# Altium project RPi-HAT-RAK831-PoE-PCB.PrjPcb
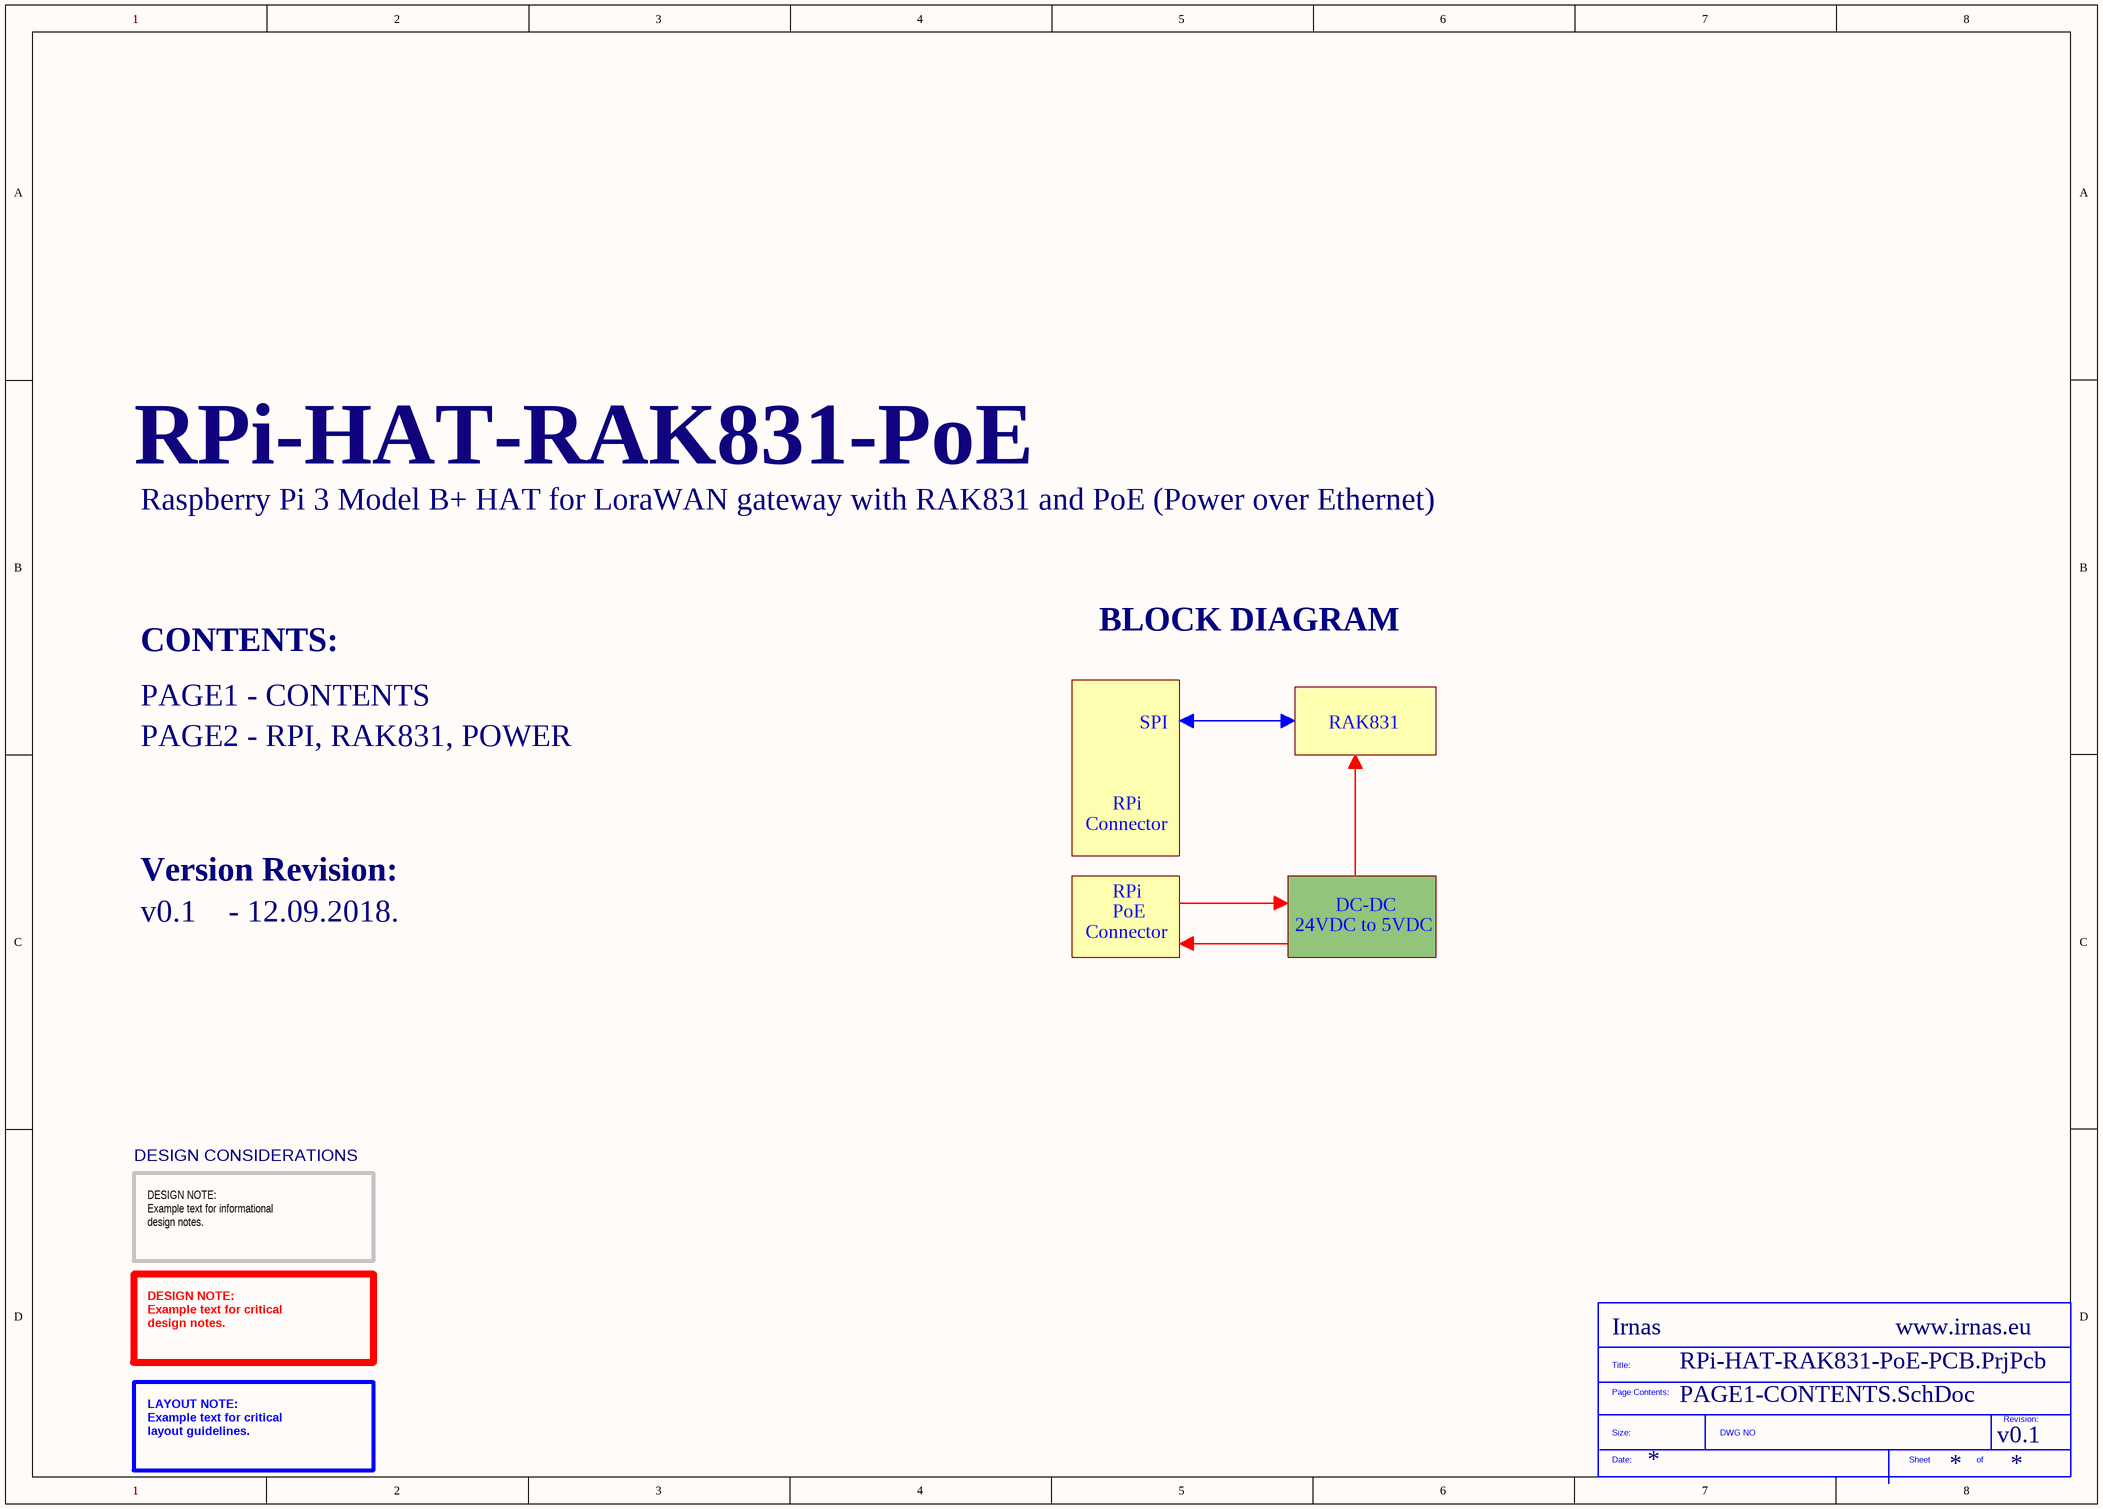
[diagram p0: PAGE1-CONTENTS.SchDoc]
Company: Irnas; ProjectTitle: RPi-HAT-RAK831-PoE; Version: v0.1; Website: www.irnas.eu
2 sheets, 11 parts. Net scope: global (net labels, ports and power ports of the same name join across sheets).
Board file: RPi-HAT-RAK831-PoE-PCB.PcbDoc
Sheets:
  PAGE1-CONTENTS.SchDoc
  PAGE2-RPI,RAK831,POWER.SchDoc

## Sheet PAGE1-CONTENTS.SchDoc
size A3

### Parts
(Parts that share a designator on the sheet are numbered #1, #2 ... from top to bottom, then left to right.)
*?#1  SDTitleBlock  (value not drawn)  (graphical)

### Notes on the sheet
- Raspberry Pi 3 Model B+ HAT for LoraWAN gateway with RAK831 and PoE (Power over Ethernet)
- BLOCK DIAGRAM
- CONTENTS:
- PAGE1 - CONTENTS
- PAGE2 - RPI, RAK831, POWER
- SPI
- RAK831
- Connector
- RPi
- Version Revision:
- PoE
- DC-DC
- v0.1    - 12.09.2018.
- 24VDC to 5VDC
- DESIGN CONSIDERATIONS
- DESIGN NOTE:
  Example text for informational
  design notes.
- DESIGN NOTE:
  Example text for critical
  design notes.
- LAYOUT NOTE:
  Example text for critical
  layout guidelines.
- (in symbol SDTitleBlock) Title:; Page Contents:; Revision:; Size:; DWG NO; Date:; Sheet; of

## Sheet PAGE2-RPI,RAK831,POWER.SchDoc
size A3
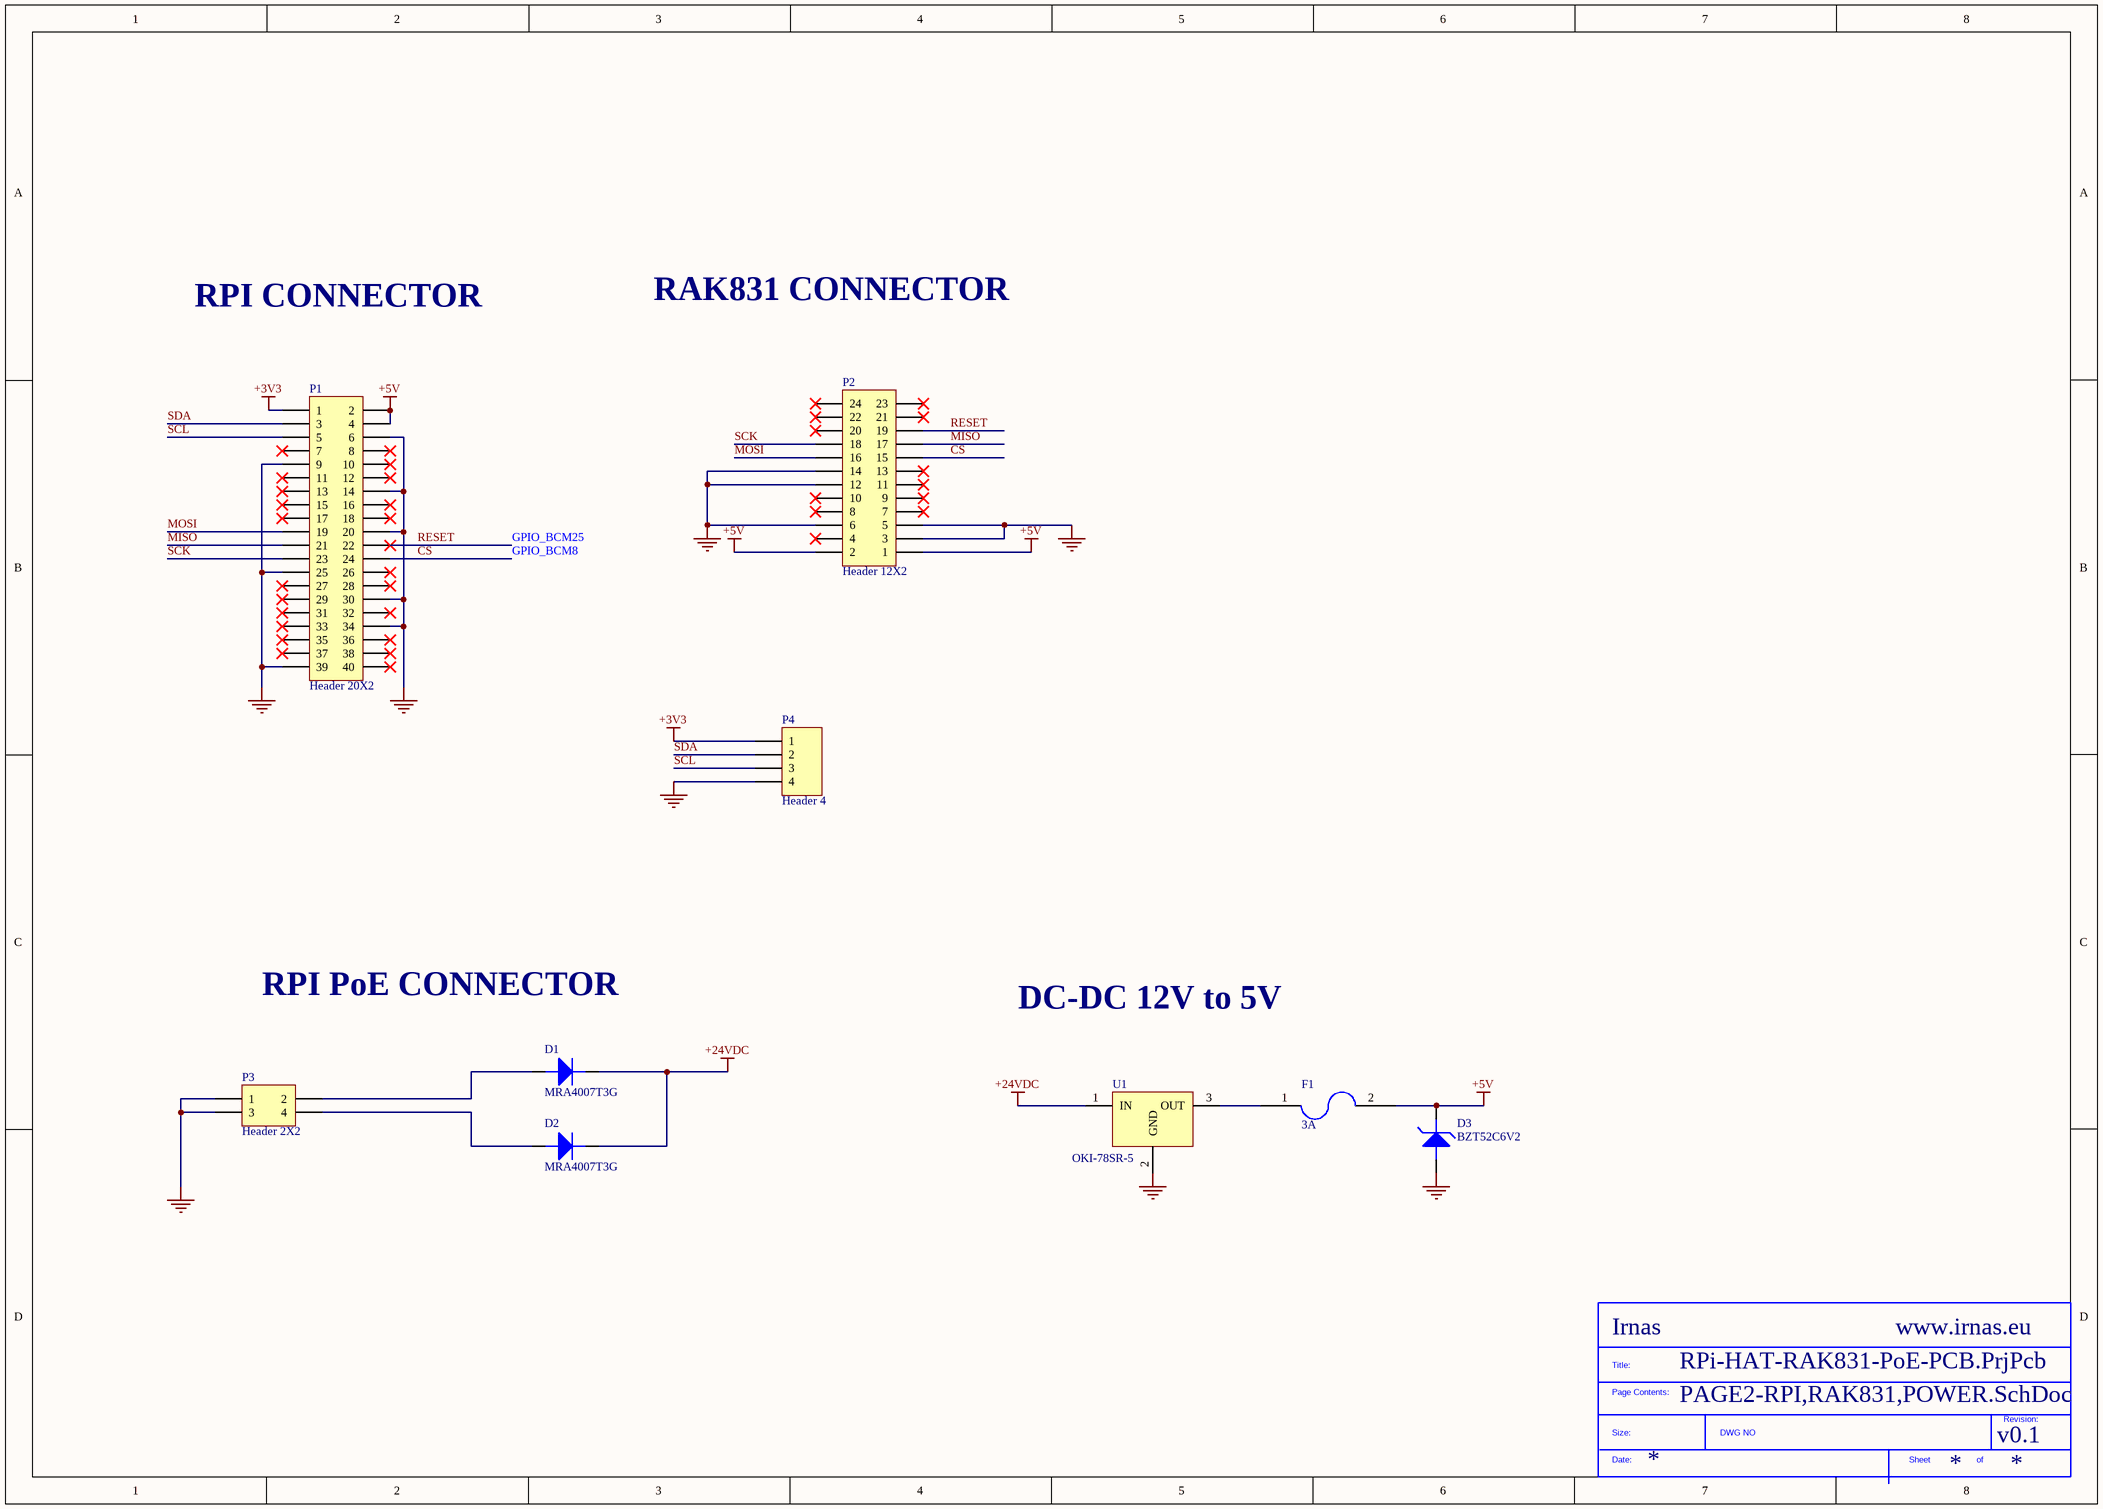
[diagram p1: PAGE2-RPI,RAK831,POWER.SchDoc]

### Parts
(Parts that share a designator on the sheet are numbered #1, #2 ... from top to bottom, then left to right.)
*?#2  SDTitleBlock  (value not drawn)  (graphical)
D1  MRA4007T3G  [DIOM4326X24N_1]
D2  MRA4007T3G  [DIOM4326X24N_1]
D3  BZT52C6V2  [SOD123]
F1  3A  [Chip2PinSM127P600-8N]
P1  Header 20X2  [HDR2X20]  (no BOM)
P2  Header 12X2  [HDR2X12]
P3  Header 2X2  [HDR2X2]
P4  Header 4  [HDR1X4]
U1  OKI-78SR-5  [DC-DC]

### Nets
+3V3: P1.1 P4.1
+5V: D3.1(cathode) F1.2 P1.2 P1.4 P2.1 P2.2
+24VDC: D1.1(cathode) D2.1(cathode) U1.1(IN)
GND: D3.2(ANODE) P1.6 P1.9 P1.14 P1.20 P1.25 P1.30 P1.34 P1.39 P2.3 P2.5 P2.6 P2.12 P2.14 P3.1 P3.3 P4.4 U1.2(GND)
~{CS}: P1.24 P2.15
MISO: P1.21 P2.17
MOSI: P1.19 P2.16
RESET: P1.22 P2.19
SCK: P1.23 P2.18
SCL: P1.5 P4.3
SDA: P1.3 P4.2
NetD1_2: D1.2(ANODE) P3.2
NetD2_2: D2.2(ANODE) P3.4
NetF1_1: F1.1 U1.3(OUT)

Not connected (* = marked no-connect by the designer): P1 7* 8* 10* 11* 12* 13* 15* 16* 17* 18* 26* 27* 28* 29* 31* 32* 33* 35* 36* 37* 38* 40*; P2 4* 7* 8* 9* 10* 11* 13* 20* 21* 22* 23* 24*

### Notes on the sheet
- RPI CONNECTOR
- RAK831 CONNECTOR
- GPIO_BCM25
- GPIO_BCM8
- RPI PoE CONNECTOR
- DC-DC 12V to 5V
- (in symbol SDTitleBlock) Title:; Page Contents:; Revision:; Size:; DWG NO; Date:; Sheet; of

### Library data of the parts
D1 D2 = MRA4007T3G: ON SEMICONDUCTOR - MRA4007T3G - DIODE, STANDARD, 1A, 1KV, SMA; Supplier 1: Farnell; Manufacturer: ON SEMICONDUCTOR; Manufacturer Part Number: MRA4007T3G; RoHS: YES; Stock 1: 92210; Pricing 1: 10=0.181, 100=0.0749, 500=0.0692, 1000=0.0478, 2500=0.0401 (GBP); ComponentLink1URL: http://www.onsemi.com/PowerSolutions/supportDoc.do?type=models&rpn=MRA4007; ComponentLink1Description: http://www.onsemi.com/PowerSolutions/supportDoc.do?type=models&rpn=MRA4007; ComponentLink2URL: http://www.farnell.com/datasheets/2028669.pdf; ComponentLink2Description: http://www.farnell.com/datasheets/2028669.pdf; ComponentLink3URL: http://www.farnell.com/datasheets/2037280.pdf; ComponentLink3Description: http://www.farnell.com/datasheets/2037280.pdf; Supplier Part Number 1: 1459137
D3 = BZT52C6V2: DIODES INC. - BZT52C6V2 - DIODE, ZENER, 6.2V, 0.5W, SOD-123; Zener Voltage Vz Typ: 6.2; Power Dissipation Pd: 500; Zener Tolerance ±: 6%; No. of Pins: 2; Product Range: BZT52 Series; SVHC: No SVHC (12-Jan-2017); Supplier 1: Farnell; Manufacturer: DIODES INC.; Manufacturer Part Number: BZT52C6V2; RoHS: YES; Stock 1: 4408; Pricing 1: 1=0.415, 25=0.264, 100=0.0727, 250=0.0546, 500=0.047, 1000=0.0334, 3000=0.0278, 7000=0.0236 (GBP); Diode Case Style: SOD-123; Operating Temperature Max: 150; Packaging: Cut Tape; Automotive Qualification Standard: -; MSL: MSL 1 - Unlimited; Operating Temperature Min: -65; Operating Temperature Range: -65°C to +150°C<!--FANDB--><div class="features-and-benefits-container"><div class="features-and-benefits-desc-container"><span class="features-and-benefits-container-desc">Zener Single Diode, 6.2 V, 500 mW, SOD-123, 6 %, 2 Pins, 150 °C</span></div><div class="features-and-benefits-description"><span class="features-benefits-value">The BZT52C6V2 is a surface mount Zener Diode with moulded plastic case, matte tin annealed over Alloy 42 lead frame (lead-free plating) terminals and cathode band polarity. It is ideally suited for automated assembly processes.</span></div><div class="features-and-benefits-list"><ul class="features-and-benefits-list-list"><li class="features-and-benefits-list-item">Planar die construction</li><li class="features-and-benefits-list-item">500mW Power dissipation</li><li class="features-and-benefits-list-item">General purpose, medium current</li><li class="features-and-benefits-list-item">Totally lead-free</li><li class="features-and-benefits-list-item">Halogen and antimony-free - Green device</li><li class="features-and-benefits-list-item">Qualified to AEC-Q101 standards for high reliability</li></ul></div><div class="features-and-benefits-applications"><ul class="features-and-benefits-value"><li class="features-and-benefits-list-item">Automation & Process Control</li></ul></div></div>; ComponentLink1URL: http://www.farnell.com/datasheets/1670962.pdf; ComponentLink1Description: http://www.farnell.com/datasheets/1670962.pdf; Supplier Part Number 1: 1902438
F1 = PTC FUSE 3A: LITTELFUSE - MINISMDC150F/24-2 - POLYSWITCH, SMD, 1812, 1.5A; Supplier 1: Farnell; Manufacturer: LITTELFUSE; Manufacturer Part Number: MINISMDC150F/24-2; RoHS: YES; Stock 1: 9256; Pricing 1: 1=0.463, 50=0.382, 100=0.327, 250=0.302, 500=0.256, 1000=0.254, 5000=0.253, 10000=0.251 (GBP); ComponentLink1URL: http://www.farnell.com/datasheets/2363925.pdf; ComponentLink1Description: http://www.farnell.com/datasheets/2363925.pdf; ComponentLink2URL: http://www.farnell.com/datasheets/2282569.pdf; ComponentLink2Description: http://www.farnell.com/datasheets/2282569.pdf; Supplier Part Number 1: 1345929
P1 = Header 20X2: Header, 20-Pin, Dual row; LatestRevisionDate: 17-Jul-2002; LatestRevisionNote: Re-released for DXP Platform.; Publisher: Altium Limited
P2 = Header 12X2: Header, 12-Pin, Dual row; LatestRevisionDate: 17-Jul-2002; LatestRevisionNote: Re-released for DXP Platform.; Publisher: Altium Limited
P3 = Header 2X2: Header, 2-Pin, Dual row; LatestRevisionDate: 17-Jul-2002; LatestRevisionNote: Re-released for DXP Platform.; Publisher: Altium Limited
P4 = Header 4: Header, 4-Pin; LatestRevisionDate: 17-Jul-2002; LatestRevisionNote: Re-released for DXP Platform.; Publisher: Altium Limited
U1 = OKI-78SR-5/1.5-W36H-C: Non-Isolated DC/DC Converters 7.5W 24V 5Vout 1.5A Horizontal Mount; Manufacturer: Murata; Min Input Voltage: 7V; Number of Outputs: 1; Output Voltage: 5V; Efficiency: 90.5%; Max Input Voltage: 36V; Max Power Dissipation: 8W; Supplier 1: Farnell; Manufacturer Part Number: OKI-78SR-5/1.5-W36H-C; Stock 1: 0; Mount: Through Hole; Case/Package: SIP; Number of Pins: 3; Weight: 2g; Min Operating Temperature: -40°C; Max Operating Temperature: 85°C; Output Power: 7.5W; Output Current: 1.5A; Package Quantity: 100; Packaging: Tray; Current - Output 1: 1.5A; Voltage - Output 1: 5V; Max Output Current: 1.5A; Isolation: Non-Isolated; Nominal Input Voltage: 24V; Features: SCP; Length: 10.4mm; Height: 0.65inch; Width: 0.3inch; Depth: 16.5mm; Lead Free: Lead Free; Supplier 2: Mouser; Supplier 3: Digi-Key; Supplier Part Number 1: 2766437; Supplier Part Number 2: 580-OKI78SR51.5W36HC; Supplier Part Number 3: 811-2692-ND; ComponentLink1Description: Datasheet; ComponentLink1URL: http://www.farnell.com/datasheets/2258973.pdf?_ga=2.59674478.2140667653.1536586666-1732261692.1498238018